# EAGLE schematic kryon-ver2.1-final (EAGLE 9.4.2)

## Sheet 1 of 8
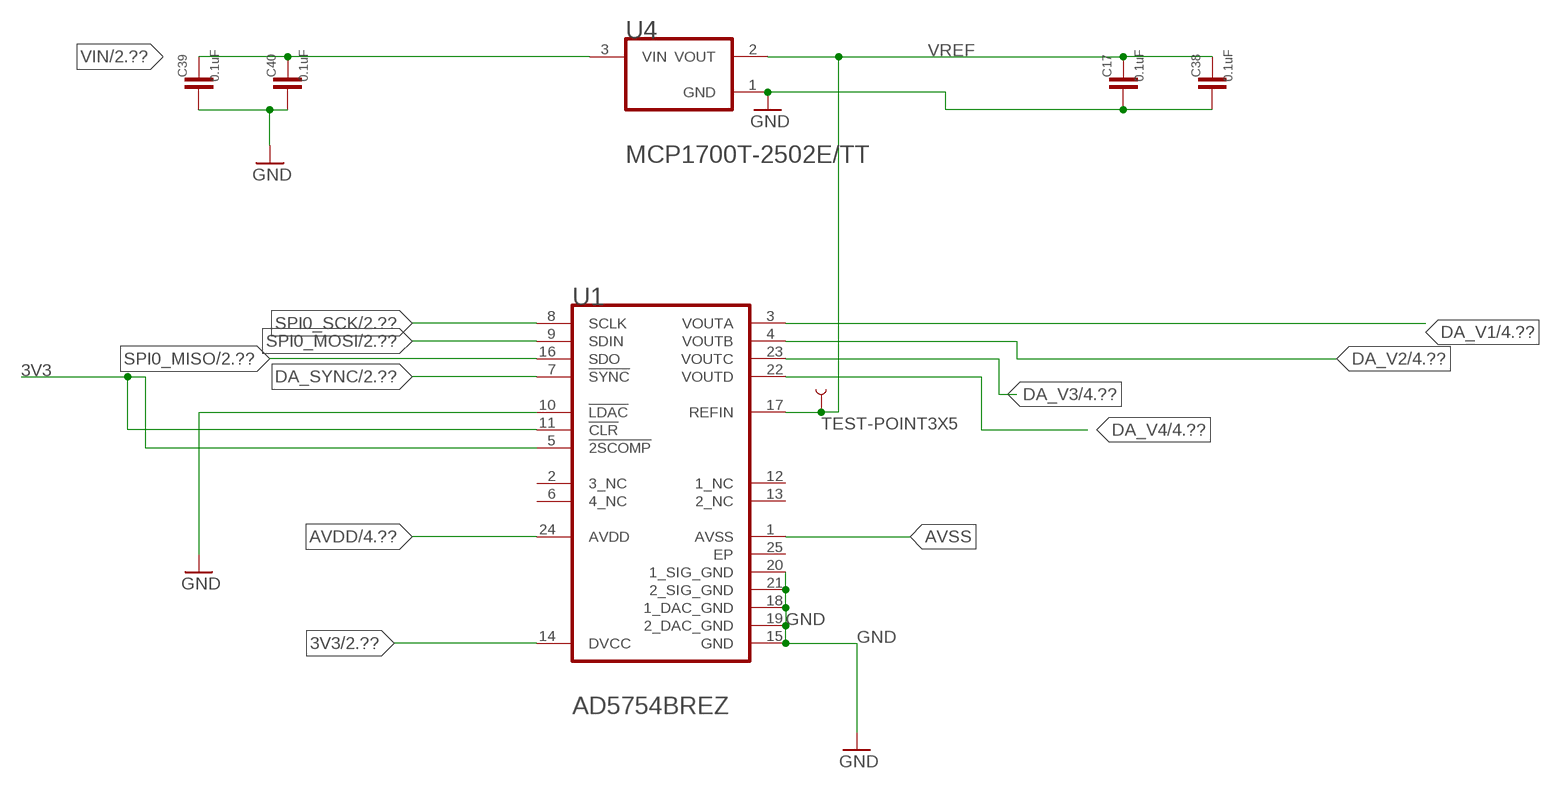
[diagram p0: schematic, sheet 1]

### Parts
C17  0.1uF  C-EUC1206  [C1206]
C38  0.1uF  C-EUC1206  [C1206]
C39  0.1uF  C-EUC1206  [C1206]
C40  0.1uF  C-EUC1206  [C1206]
TP1  TEST-POINT3X5  [PAD.03X.05]
U1  ANALOG_DEVICES_AD5754BREZANALOG_DEVICES_AD5754BREZ_0_2  [ANALOG_DEVICES_AD5754BREZ_2]
U4  MICROCHIP_MCP1700T-2502E-TTMICROCHIP_MCP1700T-2502E-TT_0_0  [MICROCHIP_MCP1700T-2502E-TT_0]

### Nets
3V3: U1.5(!2SCOMP!) U1.11(!CLR!) U1.14(DVCC) ; also sheet 2,3,4,5,6,7
AVDD: U1.24(AVDD) ; also sheet 3,4
AVSS: U1.1(AVSS) ; also sheet 3
DA_SYNC [defaultyyyy]: U1.7(!SYNC!) ; also sheet 2
DA_V1 [defaultyyyy]: U1.3(VOUTA) ; also sheet 4
DA_V2 [defaultyyyy]: U1.4(VOUTB) ; also sheet 4
DA_V3 [defaultyyyy]: U1.23(VOUTC) ; also sheet 4
DA_V4 [defaultyyyy]: U1.22(VOUTD) ; also sheet 4
GND: C17.2 C38.2 C39.2 C40.2 U1.10(!LDAC!) U1.15(GND) U1.18(1_DAC_GND) U1.19(2_DAC_GND) U1.20(1_SIG_GND) U1.21(2_SIG_GND) U4.1(GND) ; also sheet 2,3,4,5,6,8
SPI0_MISO [defaultyyyy]: U1.16(SDO) ; also sheet 2,5
SPI0_MOSI [defaultyyyy]: U1.9(SDIN) ; also sheet 2,4
SPI0_SCK [defaultyyyy]: U1.8(SCLK) ; also sheet 2,4,5
VIN: C39.1 C40.1 U4.3(VIN) ; also sheet 2,3,4,6
VREF: C17.1 C38.1 TP1.P$1 U1.17(REFIN) U4.2(VOUT)
Unconnected: U1.2(3_NC) U1.6(4_NC) U1.12(1_NC) U1.13(2_NC) U1.25(EP)

## Sheet 2 of 8
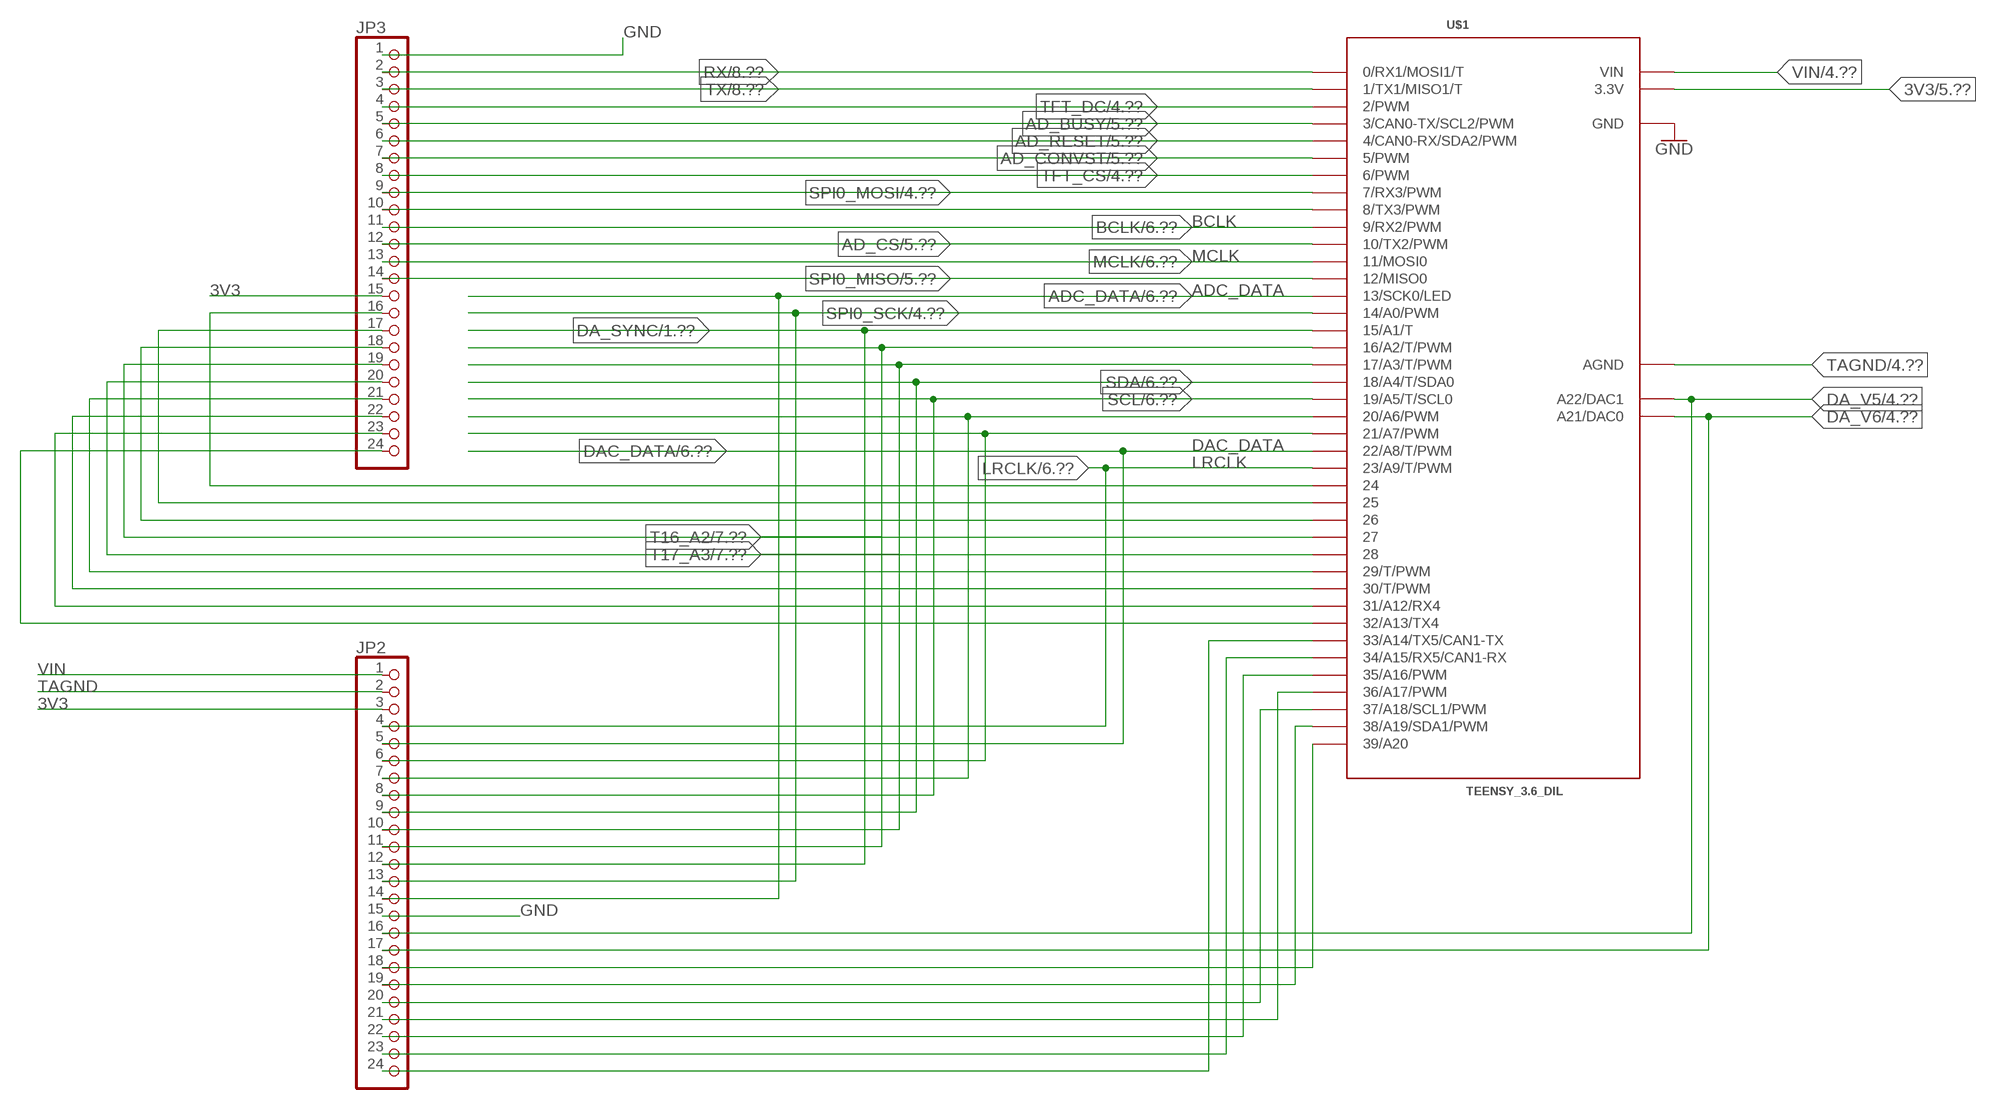
[diagram p1: schematic, sheet 2]

### Parts
JP2  PINHD-1X24  [1X24]
JP3  PINHD-1X24  [1X24]
U$1  TEENSY_3.6_DIL  [TEENSY_3.6_DIL]

### Nets
3V3: JP2.3 JP3.15 U$1.3.3V U$1.3.3V3(3.3V) ; also sheet 1,3,4,5,6,7
AD_BUSY [defaultyyyy]: JP3.5 U$1.3(3/CAN0-TX/SCL2/PWM) ; also sheet 5
AD_CONVST [defaultyyyy]: JP3.7 U$1.5(5/PWM) ; also sheet 5
AD_CS [defaultyyyy]: JP3.12 U$1.10(10/TX2/PWM) ; also sheet 5
AD_RESET [defaultyyyy]: JP3.6 U$1.4(4/CAN0-RX/SDA2/PWM) ; also sheet 5
ADC_DATA [defaultyyyy]: JP2.14 U$1.13(13/SCK0/LED) ; also sheet 6
BCLK [defaultyyyy]: JP3.11 U$1.9(9/RX2/PWM) ; also sheet 6
DA_SYNC [defaultyyyy]: JP2.12 U$1.15/A1(15/A1/T) ; also sheet 1
DA_V5 [defaultyyyy]: JP2.16 U$1.A22(A22/DAC1) ; also sheet 4
DA_V6 [defaultyyyy]: JP2.17 U$1.A21(A21/DAC0) ; also sheet 4
DAC_DATA [defaultyyyy]: JP2.5 U$1.22/A8(22/A8/T/PWM) ; also sheet 6
GND: JP2.15 JP3.1 U$1.GND U$1.GND1(GND) ; also sheet 1,3,4,5,6,8
LRCLK [defaultyyyy]: JP2.4 U$1.23/A9(23/A9/T/PWM) ; also sheet 6
MCLK [defaultyyyy]: JP3.13 U$1.11(11/MOSI0) ; also sheet 6
N$3 [defaultyyyy]: JP3.10 U$1.8(8/TX3/PWM)
N$4 [defaultyyyy]: JP2.7 U$1.20/A6(20/A6/PWM)
N$27 [defaultyyyy]: JP2.6 U$1.21/A7(21/A7/PWM)
N$28 [defaultyyyy]: JP3.16 U$1.24
N$29 [defaultyyyy]: JP3.17 U$1.25
N$31 [defaultyyyy]: JP3.18 U$1.26
N$32 [defaultyyyy]: JP3.19 U$1.27
N$33 [defaultyyyy]: JP3.20 U$1.28
N$34 [defaultyyyy]: JP3.21 U$1.29(29/T/PWM)
N$35 [defaultyyyy]: JP3.22 U$1.30(30/T/PWM)
N$36 [defaultyyyy]: JP3.23 U$1.31/A12(31/A12/RX4)
N$37 [defaultyyyy]: JP3.24 U$1.32/A13(32/A13/TX4)
N$38 [defaultyyyy]: JP2.18 U$1.39/A20
N$39 [defaultyyyy]: JP2.19 U$1.38/A19(38/A19/SDA1/PWM)
N$40 [defaultyyyy]: JP2.20 U$1.37/A18(37/A18/SCL1/PWM)
N$41 [defaultyyyy]: JP2.22 U$1.35/A16(35/A16/PWM)
N$42: JP2.21 U$1.36/A17(36/A17/PWM)
N$43 [defaultyyyy]: JP2.23 U$1.34/A15(34/A15/RX5/CAN1-RX)
N$44 [defaultyyyy]: JP2.24 U$1.33/A14(33/A14/TX5/CAN1-TX)
RX [defaultyyyy]: JP3.2 U$1.0(0/RX1/MOSI1/T) ; also sheet 8
SCL [defaultyyyy]: JP2.8 U$1.19/A5(19/A5/T/SCL0) ; also sheet 6
SDA [defaultyyyy]: JP2.9 U$1.18/A4(18/A4/T/SDA0) ; also sheet 6
SPI0_MISO [defaultyyyy]: JP3.14 U$1.12(12/MISO0) ; also sheet 1,5
SPI0_MOSI [defaultyyyy]: JP3.9 U$1.7(7/RX3/PWM) ; also sheet 1,4
SPI0_SCK [defaultyyyy]: JP2.13 U$1.14/A0(14/A0/PWM) ; also sheet 1,4,5
T16_A2 [defaultyyyy]: JP2.11 U$1.16/A2(16/A2/T/PWM) ; also sheet 7
T17_A3 [defaultyyyy]: JP2.10 U$1.17/A3(17/A3/T/PWM) ; also sheet 7
TAGND [defaultyyyy]: JP2.2 U$1.AGND ; also sheet 4,7
TFT_CS [defaultyyyy]: JP3.8 U$1.6(6/PWM) ; also sheet 4
TFT_DC [defaultyyyy]: JP3.4 U$1.2(2/PWM) ; also sheet 4
TX [defaultyyyy]: JP3.3 U$1.1(1/TX1/MISO1/T) ; also sheet 8
VIN: JP2.1 U$1.VIN ; also sheet 1,3,4,6

## Sheet 3 of 8
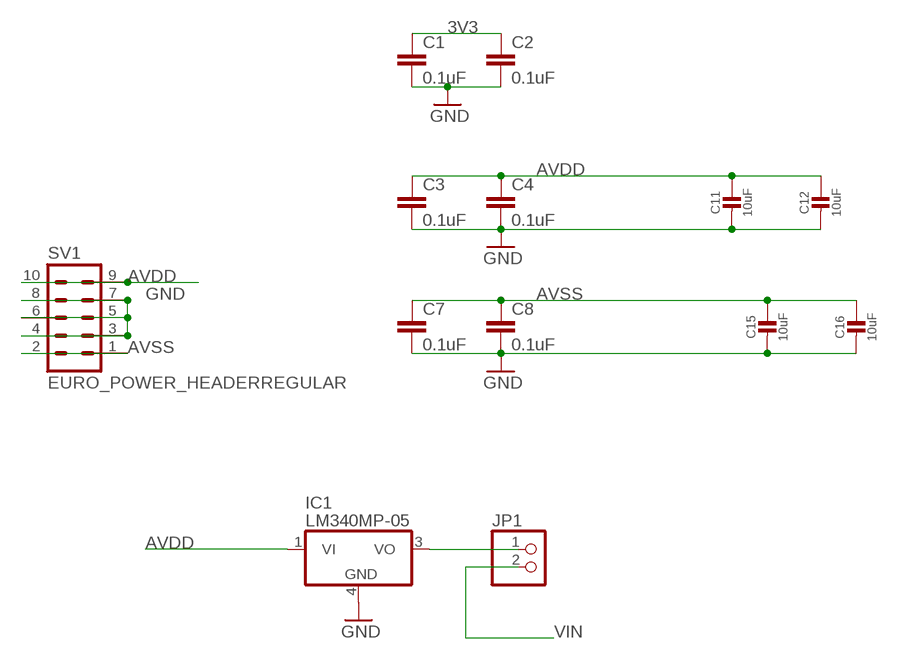
[diagram p2: schematic, sheet 3]

### Parts
C1  0.1uF  0.1UF-0603-25V-5%  [0603]
C2  0.1uF  0.1UF-0603-25V-5%  [0603]
C3  0.1uF  0.1UF-0603-25V-5%  [0603]
C4  0.1uF  0.1UF-0603-25V-5%  [0603]
C7  0.1uF  0.1UF-0603-25V-5%  [0603]
C8  0.1uF  0.1UF-0603-25V-5%  [0603]
C11  10uF  CAP_CERAMIC0805-NOOUTLINE  [0805-NO]
C12  10uF  CAP_CERAMIC0805-NOOUTLINE  [0805-NO]
C15  10uF  CAP_CERAMIC0805-NOOUTLINE  [0805-NO]
C16  10uF  CAP_CERAMIC0805-NOOUTLINE  [0805-NO]
IC1  LM340MP-05  [SOT223]
JP1  PINHD-1X2  [1X02]
SV1  EURO_POWER_HEADERREGULAR  [EURO_POWER_HEADER]

### Nets
3V3: C1.1 C2.1 ; also sheet 1,2,4,5,6,7
AVDD: C3.1 C4.1 C11.1 C12.1 IC1.1(VI) SV1.9 SV1.10 ; also sheet 1,4
AVSS: C7.1 C8.1 C15.1 C16.1 SV1.1 SV1.2 ; also sheet 1
GND: C1.2 C2.2 C3.2 C4.2 C7.2 C8.2 C11.2 C12.2 C15.2 C16.2 IC1.4(GND) SV1.3 SV1.4 SV1.5 SV1.6 SV1.7 SV1.8 ; also sheet 1,2,4,5,6,8
N$1 [defaultyyyy]: IC1.3(VO) JP1.1
VIN: JP1.2 ; also sheet 1,2,4,6

## Sheet 4 of 8
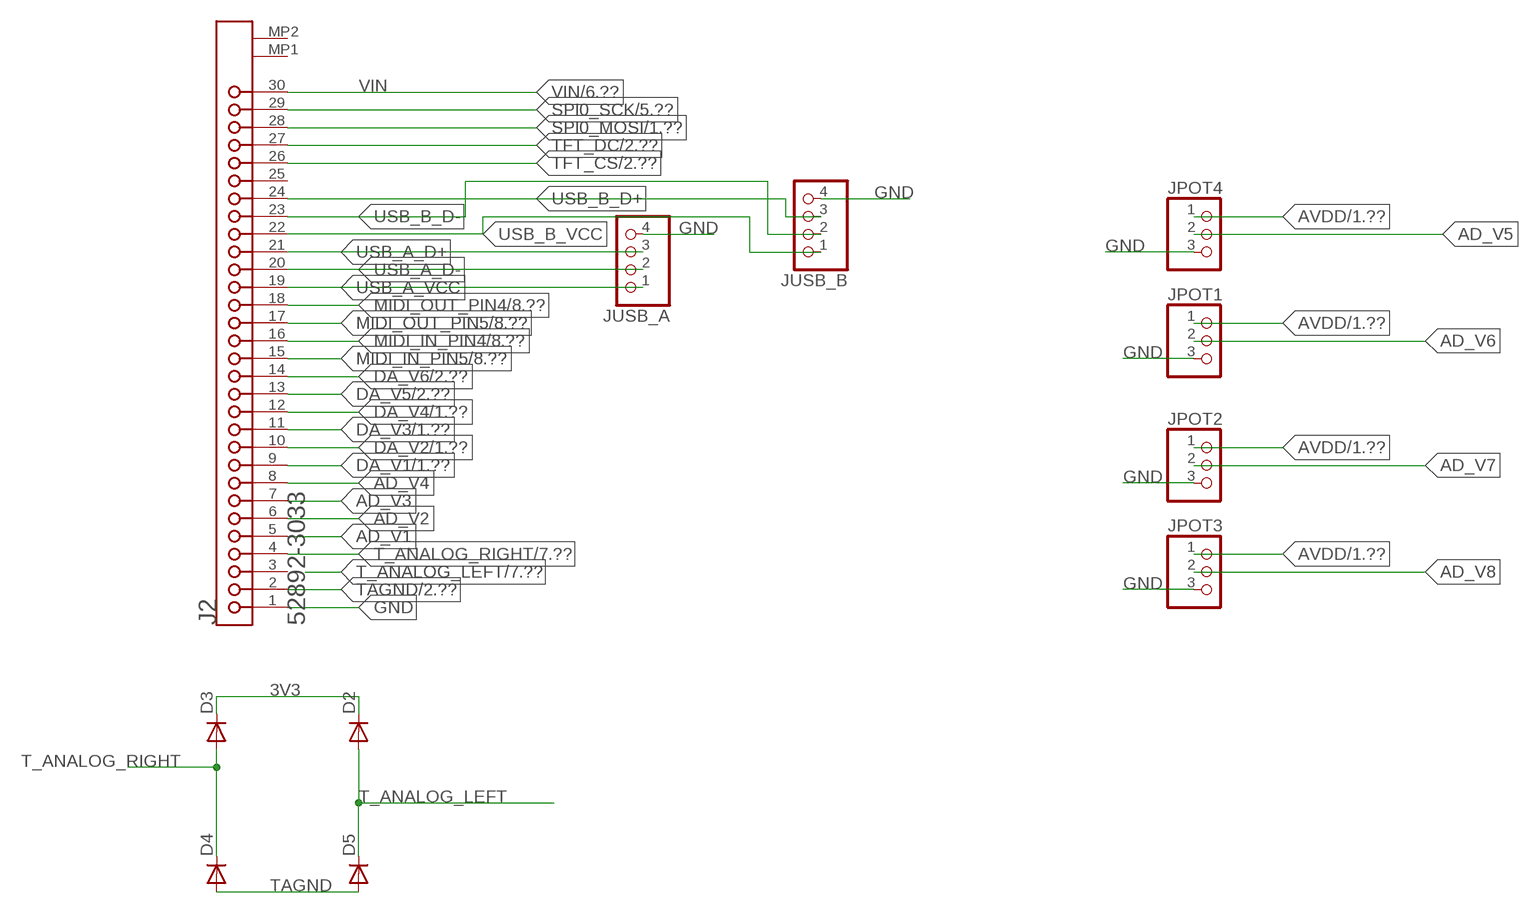
[diagram p3: schematic, sheet 4]

### Parts
D2  DIODESMA  [SMA-DIODE]
D3  DIODESMA  [SMA-DIODE]
D4  DIODESMA  [SMA-DIODE]
D5  DIODESMA  [SMA-DIODE]
J2  MOLEX_52892-3033MOLEX_52892-3033_0_0  [MOLEX_52892-3033_0]
JPOT1  PINHD-1X3  [1X03]
JPOT2  PINHD-1X3  [1X03]
JPOT3  PINHD-1X3  [1X03]
JPOT4  PINHD-1X3  [1X03]
JUSB_A  PINHD-1X4  [1X04]
JUSB_B  PINHD-1X4  [1X04]

### Nets
3V3: D2.C D3.C ; also sheet 1,2,3,5,6,7
AD_V1 [defaultyyyy]: J2.5 ; also sheet 5
AD_V2 [defaultyyyy]: J2.6 ; also sheet 5
AD_V3 [defaultyyyy]: J2.7 ; also sheet 5
AD_V4 [defaultyyyy]: J2.8 ; also sheet 5
AD_V5 [defaultyyyy]: JPOT4.2 ; also sheet 5
AD_V6 [defaultyyyy]: JPOT1.2 ; also sheet 5
AD_V7 [defaultyyyy]: JPOT2.2 ; also sheet 5
AD_V8 [defaultyyyy]: JPOT3.2 ; also sheet 5
AVDD: JPOT1.1 JPOT2.1 JPOT3.1 JPOT4.1 ; also sheet 1,3
DA_V1 [defaultyyyy]: J2.9 ; also sheet 1
DA_V2 [defaultyyyy]: J2.10 ; also sheet 1
DA_V3 [defaultyyyy]: J2.11 ; also sheet 1
DA_V4 [defaultyyyy]: J2.12 ; also sheet 1
DA_V5 [defaultyyyy]: J2.13 ; also sheet 2
DA_V6 [defaultyyyy]: J2.14 ; also sheet 2
GND: J2.1 JPOT1.3 JPOT2.3 JPOT3.3 JPOT4.3 JUSB_A.4 JUSB_B.4 ; also sheet 1,2,3,5,6,8
MIDI_IN_PIN4 [defaultyyyy]: J2.16 ; also sheet 8
MIDI_IN_PIN5 [defaultyyyy]: J2.15 ; also sheet 8
MIDI_OUT_PIN4 [defaultyyyy]: J2.18 ; also sheet 8
MIDI_OUT_PIN5 [defaultyyyy]: J2.17 ; also sheet 8
SPI0_MOSI [defaultyyyy]: J2.28 ; also sheet 1,2
SPI0_SCK [defaultyyyy]: J2.29 ; also sheet 1,2,5
T_ANALOG_LEFT [defaultyyyy]: D2.A D5.C ; also sheet 7
T_ANALOG_RIGHT [defaultyyyy]: D3.A D4.C J2.4 ; also sheet 7
TAGND [defaultyyyy]: D4.A D5.A J2.2 ; also sheet 2,7
TFT_CS [defaultyyyy]: J2.26 ; also sheet 2
TFT_DC [defaultyyyy]: J2.27 ; also sheet 2
USB_A_D+ [defaultyyyy]: J2.21 JUSB_A.3
USB_A_D- [defaultyyyy]: J2.20 JUSB_A.2
USB_A_VCC [defaultyyyy]: J2.19 JUSB_A.1
USB_B_D+ [defaultyyyy]: J2.24 JUSB_B.3
USB_B_D- [defaultyyyy]: J2.23 JUSB_B.2
USB_B_VCC [defaultyyyy]: J2.22 JUSB_B.1
VIN: J2.30 ; also sheet 1,2,3,6
Unconnected: J2.3 J2.25 J2.MP1 J2.MP2

## Sheet 5 of 8
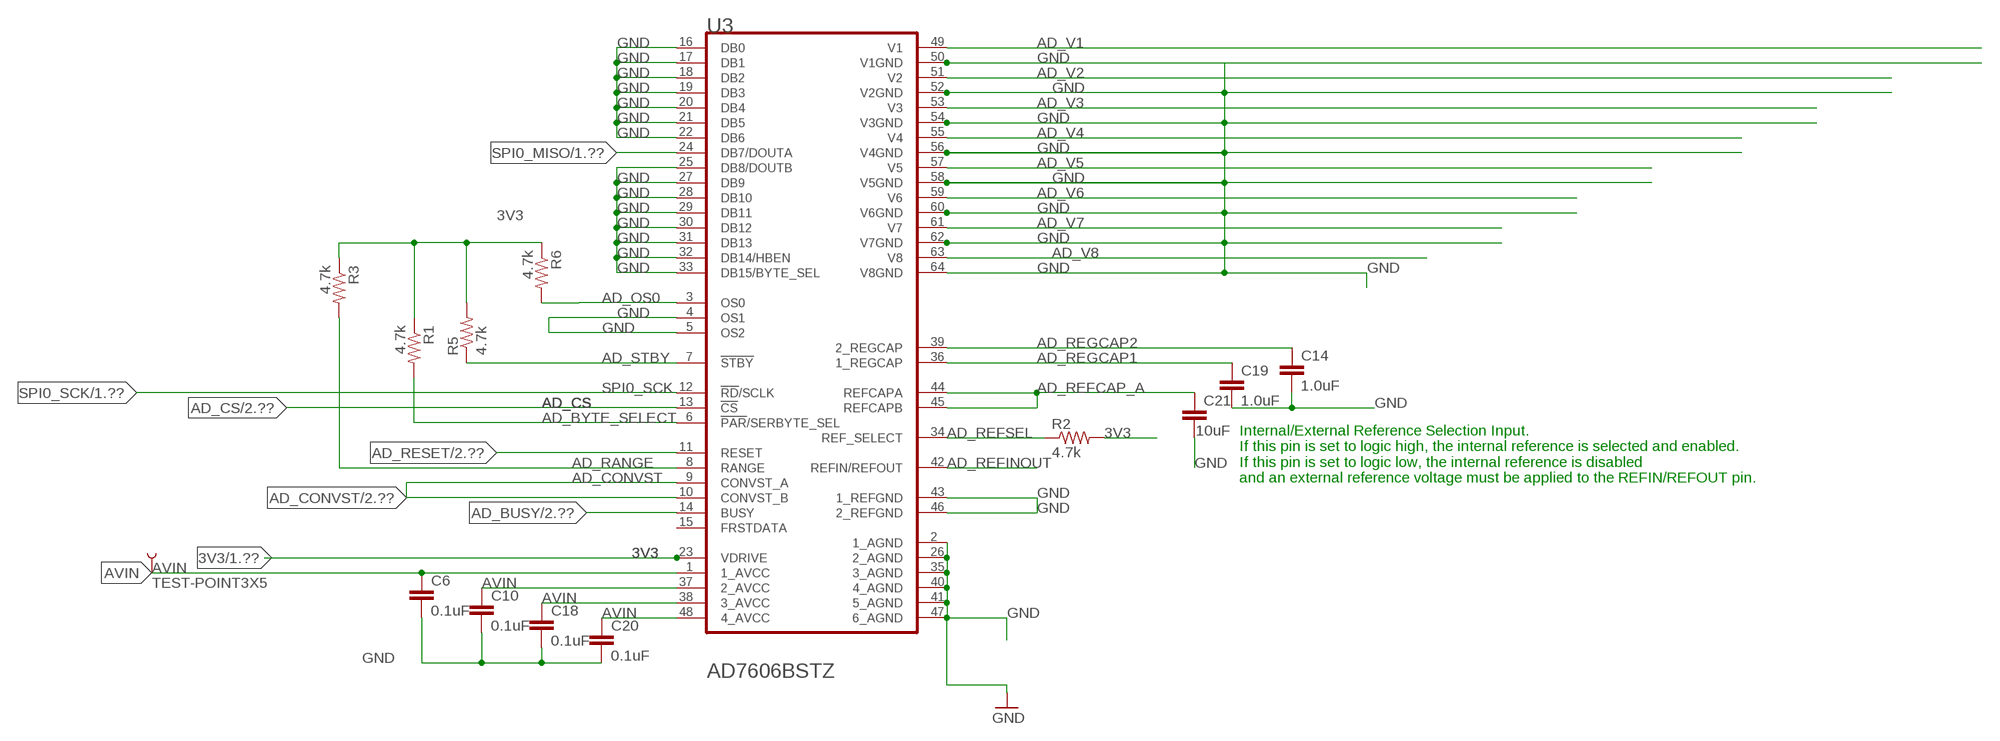
[diagram p4: schematic, sheet 5]

### Parts
C6  0.1uF  0.1UF-0603-25V-5%  [0603]
C10  0.1uF  0.1UF-0603-25V-5%  [0603]
C14  1.0uF  1.0UF-1206-50V-10%  [1206]
C18  0.1uF  0.1UF-0603-25V-5%  [0603]
C19  1.0uF  1.0UF-1206-50V-10%  [1206]
C20  0.1uF  0.1UF-0603-25V-5%  [0603]
C21  10uF  10UF-1206-6.3V-20%  [1206]
R1  4.7k  R-US_R0805  [R0805]
R2  4.7k  R-US_R0805  [R0805]
R3  4.7k  R-US_R0805  [R0805]
R5  4.7k  R-US_R0805  [R0805]
R6  4.7k  R-US_R0805  [R0805]
TP2  TEST-POINT3X5  [PAD.03X.05]
U3  ANALOG_DEVICES_AD7606BSTZANALOG_DEVICES_AD7606BSTZ_0_2  [ANALOG_DEVICES_AD7606BSTZ_2]

### Nets
3V3: R1.1 R2.2 R3.1 R5.2 R6.1 U3.23(VDRIVE) ; also sheet 1,2,3,4,6,7
AD_BUSY [defaultyyyy]: U3.14(BUSY) ; also sheet 2
AD_BYTE_SELECT [defaultyyyy]: R1.2 U3.6(!PAR!/SERBYTE_SEL)
AD_CONVST [defaultyyyy]: U3.9(CONVST_A) U3.10(CONVST_B) ; also sheet 2
AD_CS [defaultyyyy]: U3.13(!CS!) ; also sheet 2
AD_OS0 [defaultyyyy]: R6.2 U3.3(OS0)
AD_RANGE [defaultyyyy]: R3.2 U3.8(RANGE)
AD_REFCAP_A [defaultyyyy]: C21.1 U3.44(REFCAPA) U3.45(REFCAPB)
AD_REFINOUT [defaultyyyy]: U3.42(REFIN/REFOUT)
AD_REFSEL [defaultyyyy]: R2.1 U3.34(REF_SELECT)
AD_REGCAP1 [defaultyyyy]: C19.1 U3.36(1_REGCAP)
AD_REGCAP2 [defaultyyyy]: C14.1 U3.39(2_REGCAP)
AD_RESET [defaultyyyy]: U3.11(RESET) ; also sheet 2
AD_STBY [defaultyyyy]: R5.1 U3.7(!STBY!)
AD_V1 [defaultyyyy]: U3.49(V1) ; also sheet 4
AD_V2 [defaultyyyy]: U3.51(V2) ; also sheet 4
AD_V3 [defaultyyyy]: U3.53(V3) ; also sheet 4
AD_V4 [defaultyyyy]: U3.55(V4) ; also sheet 4
AD_V5 [defaultyyyy]: U3.57(V5) ; also sheet 4
AD_V6 [defaultyyyy]: U3.59(V6) ; also sheet 4
AD_V7 [defaultyyyy]: U3.61(V7) ; also sheet 4
AD_V8 [defaultyyyy]: U3.63(V8) ; also sheet 4
AVIN: C6.1 C10.1 C18.1 C20.1 TP2.P$1 U3.1(1_AVCC) U3.37(2_AVCC) U3.38(3_AVCC) U3.48(4_AVCC) ; also sheet 6
GND: C6.2 C10.2 C14.2 C18.2 C19.2 C20.2 C21.2 U3.2(1_AGND) U3.4(OS1) U3.5(OS2) U3.16(DB0) U3.17(DB1) U3.18(DB2) U3.19(DB3) U3.20(DB4) U3.21(DB5) U3.22(DB6) U3.25(DB8/DOUTB) U3.26(2_AGND) U3.27(DB9) U3.28(DB10) U3.29(DB11) U3.30(DB12) U3.31(DB13) U3.32(DB14/HBEN) U3.33(DB15/BYTE_SEL) U3.35(3_AGND) U3.40(4_AGND) U3.41(5_AGND) U3.43(1_REFGND) U3.46(2_REFGND) U3.47(6_AGND) U3.50(V1GND) U3.52(V2GND) U3.54(V3GND) U3.56(V4GND) U3.58(V5GND) U3.60(V6GND) U3.62(V7GND) U3.64(V8GND) ; also sheet 1,2,3,4,6,8
SPI0_MISO [defaultyyyy]: U3.24(DB7/DOUTA) ; also sheet 1,2
SPI0_SCK [defaultyyyy]: U3.12(!RD!/SCLK) ; also sheet 1,2,4
Unconnected: U3.15(FRSTDATA)

### Notes on the sheet
- Internal/External Reference Selection Input. 
  If this pin is set to logic high, the internal reference is selected and enabled. 
  If this pin is set to logic low, the internal reference is disabled 
  and an external reference voltage must be applied to the REFIN/REFOUT pin.

## Sheet 6 of 8: codec
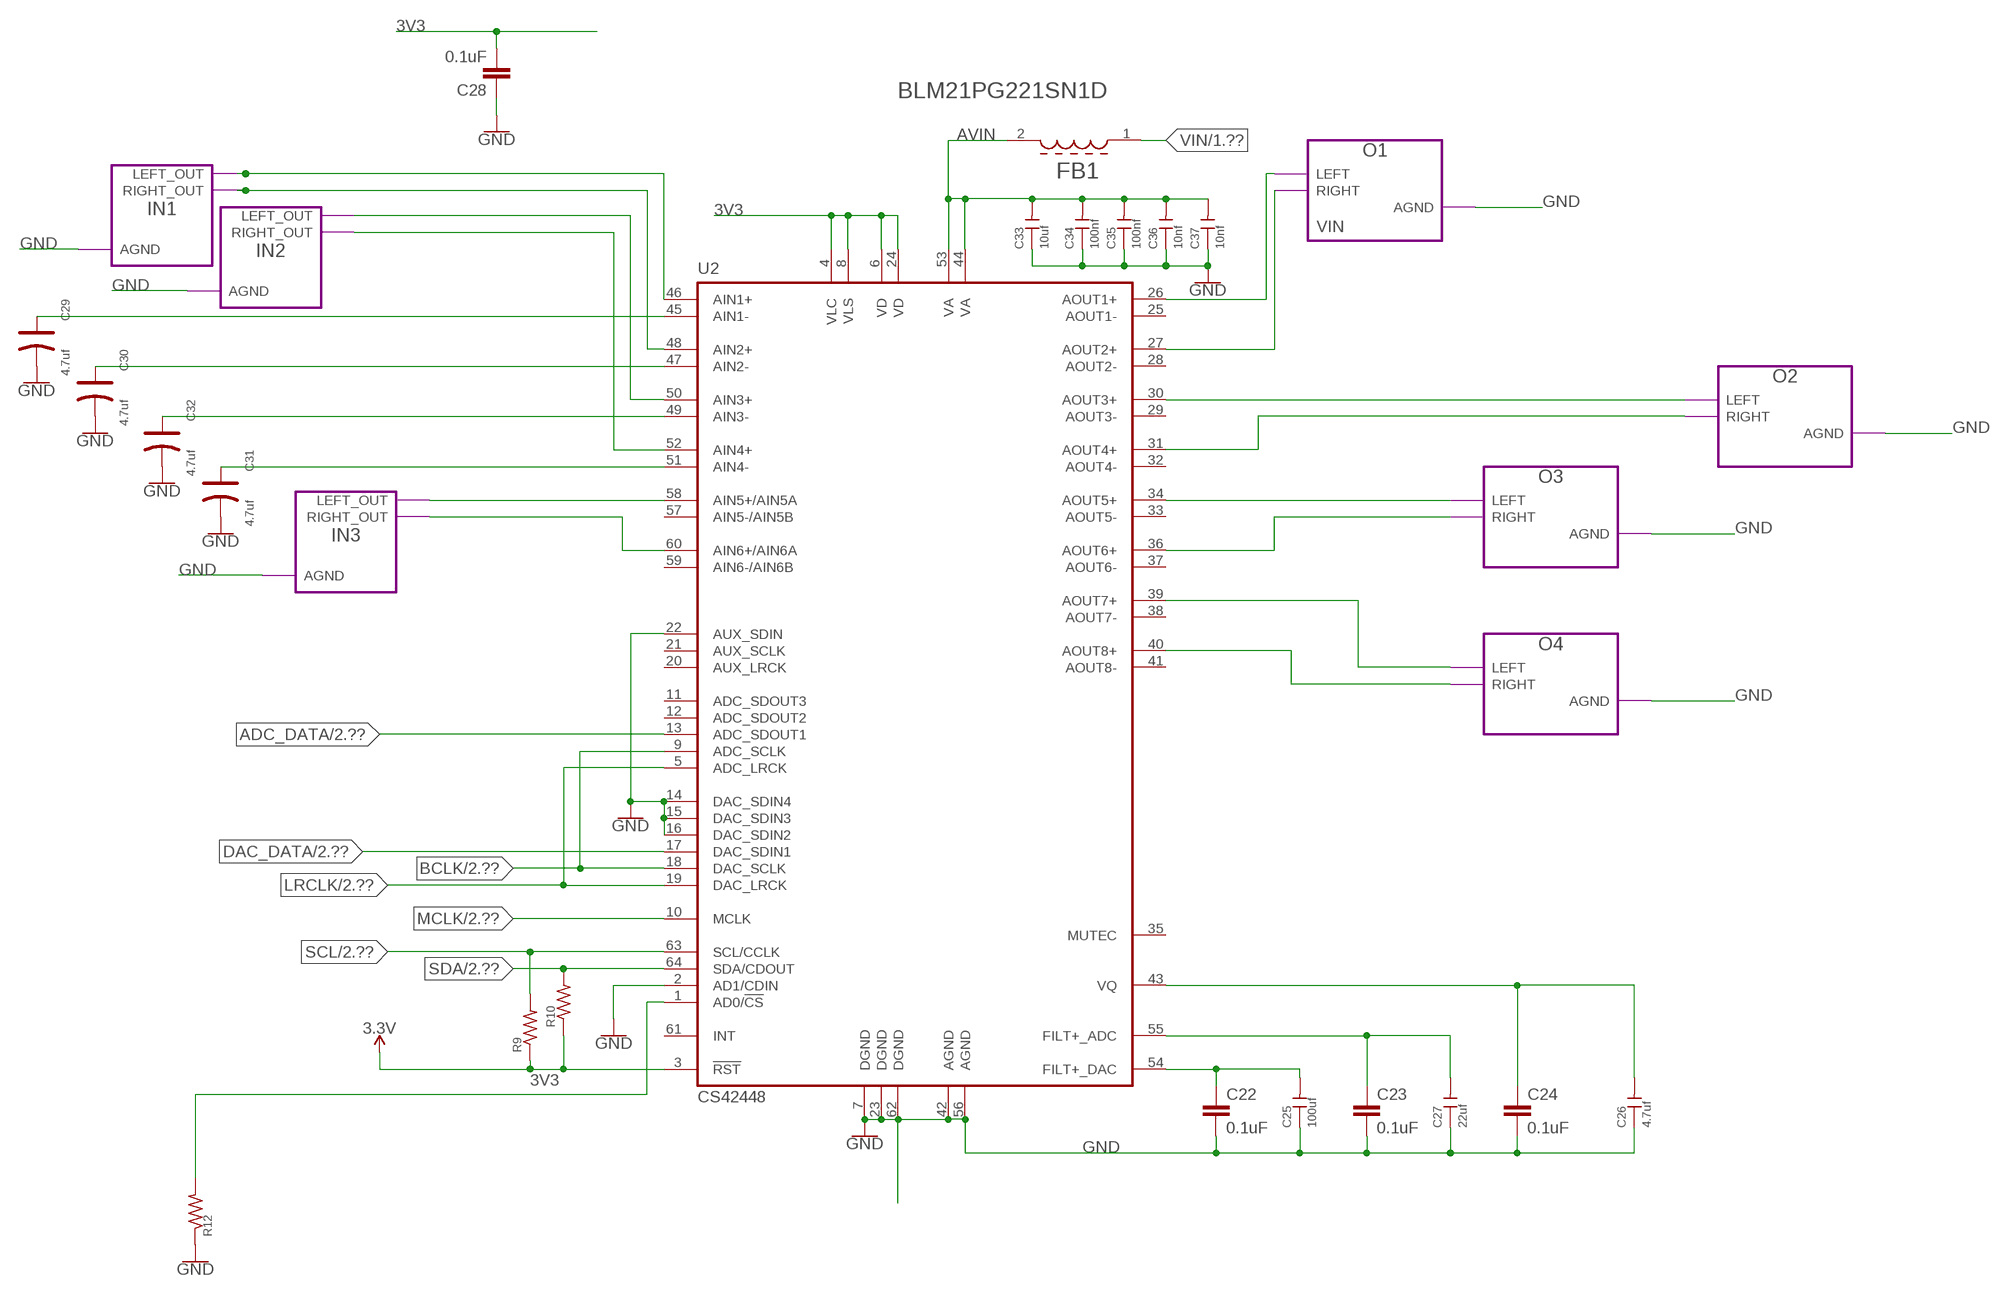
[diagram p5: schematic, sheet 6]

### Parts
C22  0.1uF  0.1UF-0603-25V-5%  [0603]
C23  0.1uF  0.1UF-0603-25V-5%  [0603]
C24  0.1uF  0.1UF-0603-25V-5%  [0603]
C25  100uf  CERAMIC-100UF-6.3V-20%-X5R(1206)  [C1206]
C26  4.7uf  CERAMIC-4.7UF-25V-10%-X5R(0805)  [C0805]
C27  22uf  CERAMIC-22UF-6.3V-20%-X5R(0805)  [C0805]
C28  0.1uF  0.1UF-0603-25V-5%  [0603]
C29  4.7uf  TANTALUM-SMD-4.7UF-16V(AVX-A)  [AVX-A]
C30  4.7uf  TANTALUM-SMD-4.7UF-16V(AVX-A)  [AVX-A]
C31  4.7uf  TANTALUM-SMD-4.7UF-16V(AVX-A)  [AVX-A]
C32  4.7uf  TANTALUM-SMD-4.7UF-16V(AVX-A)  [AVX-A]
C33  10uf  CERAMIC-10UF-25V-10%-X5R(0805)  [C0805]
C34  100nf  CERAMIC-100NF-50V-10%-X7R(0805)  [C0805]
C35  100nf  CERAMIC-100NF-50V-10%-X7R(0805)  [C0805]
C36  10nf  CERAMIC-10NF-50V-5%-X7R(0805)  [C0805]
C37  10nf  CERAMIC-10NF-50V-5%-X7R(0805)  [C0805]
FB1  MURATA_BLM21PG221SN1DMURATA_BLM21PG221SN1D_0_1  [MURATA_BLM21PG221SN1D_1]
R9  2K  R-US_R0805  [R0805]
R10  2K  R-US_R0805  [R0805]
R12  2K  R-US_R0805  [R0805]
U2  CS42448  [LQFP64L]

### Module instances
O1 = STEREO_OUT
O2 = STEREO_OUT
O3 = STEREO_OUT
O4 = STEREO_OUT
IN1 = STEREO_IN
IN2 = STEREO_IN
IN3 = STEREO_IN

### Nets
3V3: C28.2 R9.1 R10.1 U2.3(!RST!) U2.4(VLC) U2.6(VD) U2.8(VLS) U2.24(VD) ; supply symbol labelled 3.3V ; also sheet 1,2,3,4,5,7
ADC_DATA [defaultyyyy]: U2.13(ADC_SDOUT1) ; also sheet 2
AVIN: C33.2 C34.2 C35.2 C36.2 C37.2 FB1.2 U2.44(VA) U2.53(VA) ; also sheet 5
BCLK [defaultyyyy]: U2.9(ADC_SCLK) U2.18(DAC_SCLK) ; also sheet 2
DAC_DATA [defaultyyyy]: U2.17(DAC_SDIN1) ; also sheet 2
GND: C22.2 C23.2 C24.2 C25.1 C26.1 C27.1 C28.1 C29.- C30.- C31.- C32.- C33.1 C34.1 C35.1 C36.1 C37.1 R12.1 U2.2(AD1/CDIN) U2.7(DGND) U2.14(DAC_SDIN4) U2.15(DAC_SDIN3) U2.16(DAC_SDIN2) U2.22(AUX_SDIN) U2.23(DGND) U2.42(AGND) U2.56(AGND) U2.62(DGND) ; port O1.AGND IN1.AGND IN2.AGND IN3.AGND O2.AGND O3.AGND O4.AGND ; also sheet 1,2,3,4,5,8
LRCLK [defaultyyyy]: U2.5(ADC_LRCK) U2.19(DAC_LRCK) ; also sheet 2
MCLK [defaultyyyy]: U2.10(MCLK) ; also sheet 2
N$5 [defaultyyyy]: C22.1 C25.2 U2.54(FILT+_DAC)
N$6 [defaultyyyy]: C23.1 C27.2 U2.55(FILT+_ADC)
N$7 [defaultyyyy]: C24.1 C26.2 U2.43(VQ)
N$8 [defaultyyyy]: C29.+ U2.45(AIN1-)
N$9 [defaultyyyy]: C30.+ U2.47(AIN2-)
N$10 [defaultyyyy]: U2.46(AIN1+) ; port IN1.LEFT_OUT
N$12 [defaultyyyy]: U2.48(AIN2+) ; port IN1.RIGHT_OUT
N$13 [defaultyyyy]: U2.58(AIN5+/AIN5A) ; port IN3.LEFT_OUT
N$14 [defaultyyyy]: U2.52(AIN4+) ; port IN2.RIGHT_OUT
N$15 [defaultyyyy]: U2.50(AIN3+) ; port IN2.LEFT_OUT
N$16 [defaultyyyy]: C31.+ U2.51(AIN4-)
N$17 [defaultyyyy]: U2.26(AOUT1+) ; port O1.LEFT
N$18 [defaultyyyy]: U2.27(AOUT2+) ; port O1.RIGHT
N$19 [defaultyyyy]: U2.30(AOUT3+) ; port O2.LEFT
N$20 [defaultyyyy]: C32.+ U2.49(AIN3-)
N$21 [defaultyyyy]: U2.31(AOUT4+) ; port O2.RIGHT
N$22 [defaultyyyy]: U2.34(AOUT5+) ; port O3.LEFT
N$23 [defaultyyyy]: U2.36(AOUT6+) ; port O3.RIGHT
N$24 [defaultyyyy]: U2.39(AOUT7+) ; port O4.LEFT
N$25 [defaultyyyy]: U2.40(AOUT8+) ; port O4.RIGHT
N$26 [defaultyyyy]: R12.2 U2.1(AD0/!CS!)
N$30 [defaultyyyy]: U2.60(AIN6+/AIN6A) ; port IN3.RIGHT_OUT
SCL [defaultyyyy]: R9.2 U2.63(SCL/CCLK) ; also sheet 2
SDA [defaultyyyy]: R10.2 U2.64(SDA/CDOUT) ; also sheet 2
VIN: FB1.1 ; also sheet 1,2,3,4
Unconnected: U2.11(ADC_SDOUT3) U2.12(ADC_SDOUT2) U2.20(AUX_LRCK) U2.21(AUX_SCLK) U2.25(AOUT1-) U2.28(AOUT2-) U2.29(AOUT3-) U2.32(AOUT4-) U2.33(AOUT5-) U2.35(MUTEC) U2.37(AOUT6-) U2.38(AOUT7-) U2.41(AOUT8-) U2.57(AIN5-/AIN5B) U2.59(AIN6-/AIN6B) U2.61(INT)

## Sheet 7 of 8
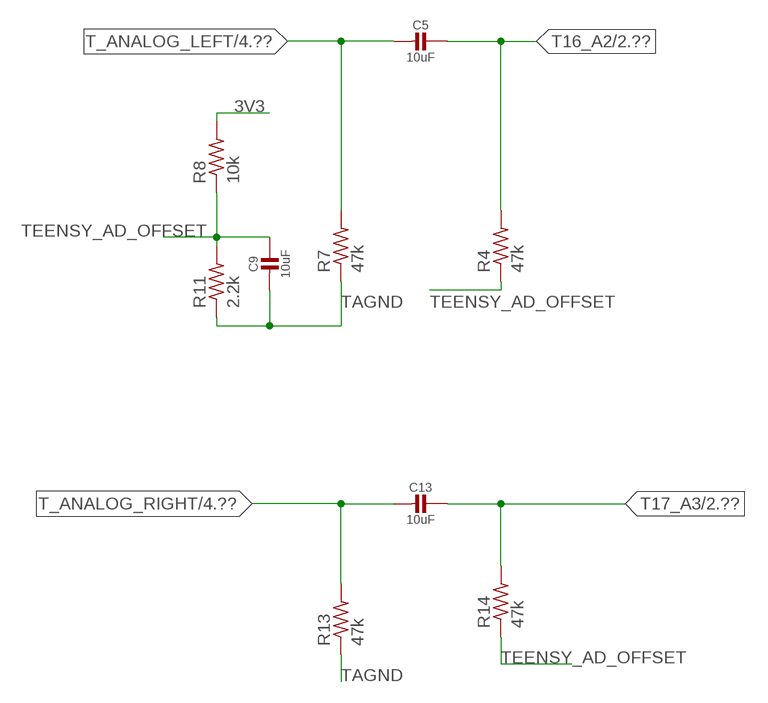
[diagram p6: schematic, sheet 7]

### Parts
C5  10uF  CAP_CERAMIC0805-NOOUTLINE  [0805-NO]
C9  10uF  CAP_CERAMIC0805-NOOUTLINE  [0805-NO]
C13  10uF  CAP_CERAMIC0805-NOOUTLINE  [0805-NO]
R4  47k  R-US_R0805  [R0805]
R7  47k  R-US_R0805  [R0805]
R8  10k  R-US_R0805  [R0805]
R11  2.2k  R-US_R0805  [R0805]
R13  47k  R-US_R0805  [R0805]
R14  47k  R-US_R0805  [R0805]

### Nets
3V3: R8.2 ; also sheet 1,2,3,4,5,6
T16_A2 [defaultyyyy]: C5.1 R4.2 ; also sheet 2
T17_A3 [defaultyyyy]: C13.1 R14.2 ; also sheet 2
T_ANALOG_LEFT [defaultyyyy]: C5.2 R7.2 ; also sheet 4
T_ANALOG_RIGHT [defaultyyyy]: C13.2 R13.2 ; also sheet 4
TAGND [defaultyyyy]: C9.2 R7.1 R11.1 R13.1 ; also sheet 2,4
TEENSY_AD_OFFSET [defaultyyyy]: C9.1 R4.1 R8.1 R11.2 R14.1

## Sheet 8 of 8: Midi
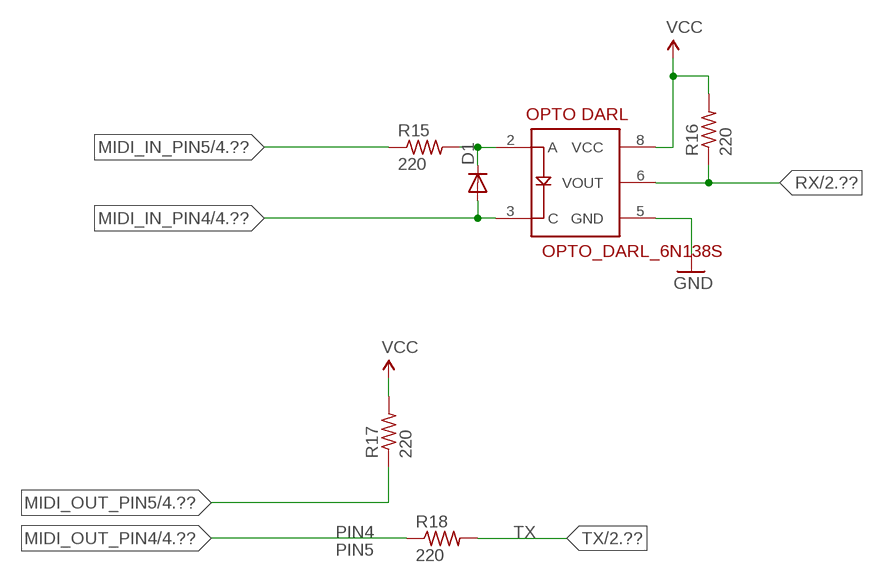
[diagram p7: schematic, sheet 8]

### Parts
D1  DIODESMA  [SMA-DIODE]
R15  220  R-US_R0805  [R0805]
R16  220  R-US_R0805  [R0805]
R17  220  R-US_R0805  [R0805]
R18  220  R-US_R0805  [R0805]
U$2  OPTO_DARL_6N138S  [8-SMD]

### Nets
56 [defaultyyyy]: D1.C R15.2 U$2.2(A)
GND: U$2.5(GND) ; also sheet 1,2,3,4,5,6
MIDI_IN_PIN4 [defaultyyyy]: D1.A U$2.3(C) ; also sheet 4
MIDI_IN_PIN5 [defaultyyyy]: R15.1 ; also sheet 4
MIDI_OUT_PIN4 [defaultyyyy]: R18.1 ; also sheet 4
MIDI_OUT_PIN5 [defaultyyyy]: R17.1 ; also sheet 4
RX [defaultyyyy]: R16.1 U$2.6(VOUT) ; also sheet 2
TX [defaultyyyy]: R18.2 ; also sheet 2
VCC: R16.2 R17.2 U$2.8(VCC)

### Notes on the sheet
- PIN4
- PIN5

## Library data of the parts
C1-C4 C6-C8 C10 C18 C20 C22-C24 C28 = SparkFun-Capacitors:0.1UF: 0.1µF ceramic capacitors A capacitor is a passive two-terminal electrical component used to store electrical energy temporarily in an electric field.; PROD_ID: CAP-08604
C5 C9 C11-C13 C15 C16 = audio amplifier example:CAP_CERAMIC
C14 C19 = SparkFun-Capacitors:1.0UF: 1µF ceramic capacitors A capacitor is a passive two-terminal electrical component used to store electrical energy temporarily in an electric field.; PROD_ID: CAP-09822
C17 C38-C40 = resistor-nick:C-EU: CAPACITOR, European symbol
C21 = SparkFun-Capacitors:10UF: 10.0µF ceramic capacitors A capacitor is a passive two-terminal electrical component used to store electrical energy temporarily in an electric field.; PROD_ID: CAP-10057
C25 = Seeed-Capacitor:CERAMIC-100UF-6.3V-20%-X5R(1206): 302010183; MPN: GRM31CR60J107ME39L
C26 = Seeed-Capacitor:CERAMIC-4.7UF-25V-10%-X5R(0805): 302010146; MPN: CC0805KKX5R8BB475
C27 = Seeed-Capacitor:CERAMIC-22UF-6.3V-20%-X5R(0805): 302010171; MPN: CC0805MKX5R5BB226
C29-C32 = Seeed-Capacitor:TANTALUM-SMD-4.7UF-16V(AVX-A): 302020006; MPN: TAJA475*016#NJ
C33 = Seeed-Capacitor:CERAMIC-10UF-25V-10%-X5R(0805): 302010178; MPN: CC0805KKX5R8BB106
C34 C35 = Seeed-Capacitor:CERAMIC-100NF-50V-10%-X7R(0805): 302010165; MPN: CC0805KRX7R9BB104
C36 C37 = Seeed-Capacitor:CERAMIC-10NF-50V-5%-X7R(0805): 302010175; MPN: CC0805JRX7R9BB103
D1-D5 = SparkFun:DIODE: Diode These are standard reverse protection diodes and small signal diodes. SMA package can handle up to about 1A. SOD-323 can handle about 200mA. What the SOD-323 package when ordering, there are some mfgs out there that are 5-pin packages.
FB1 = Murata - BLM21PG221SN1D:MURATA_BLM21PG221SN1D: MURA-FB-2; CIIVA_IDS: 886556; COMPONENT_LINK_1_DESCRIPTION: Manufacturer URL; COMPONENT_LINK_1_URL: http://www.murata.com/; COMPONENT_LINK_3_DESCRIPTION: Package Specification; COMPONENT_LINK_3_URL: http://www.murata.com/products/catalog/pdf/c31e.pdf; DATASHEET: http://www.murata.com/products/catalog/pdf/c31e.pdf; DATASHEET_VERSION: 08/2013; DC_RESISTANCE: 0.045 Ohm Max.; FOOTPRINT_VARIANT_NAME_0: MURA-BLM21-B20-CHIP-2_V2; FOOTPRINT_VARIANT_NAME_1: MURA-BLM21-B20-CHIP-2_V1; IMPEDANCE_AT_100_MHZ: 220 Ohm +/- 25%; IMPORTED: yes; IMPORTED_FROM: vault; IMPORT_TS: 1521843617; MF: Murata; MOUNTING_TECHNOLOGY: Surface Mount; MPN: BLM21PG221SN1D; OPERATING_TEMPERATURE_RANGE: -55 to 125 degC; PACKAGE: BLM21_H1050-2; PACKAGE_DESCRIPTION: 2-Pin Chip, Body 2 x 1.25 mm; PACKING: Tape and Reel; PREFIX: FB; RATED_CURRENT: 2000 mA; RELEASE_DATE: 1390571351; VAULT_GUID: D6414E20-2109-4A17-A638-53E055BFA7B6; VAULT_REVISION: E9EAA9AD-C8DD-4E35-B9CB-2397DCCBD7BA
IC1 = linear:LM340?-*: Positive VOLTAGE REGULATOR Source: http://cache.national.com/ds/LM/LM340.pdf
J2 = Molex - 52892-3033:MOLEX_52892-3033: MOLX-52892-3033; CIIVA_IDS: 12958047; CIRCUITS_LOADED: 30; COMPONENT_LINK_1_DESCRIPTION: Manufacturer URL; COMPONENT_LINK_1_URL: http://www.molex.com/molex/index.jsp; COMPONENT_LINK_3_DESCRIPTION: Package Specification; COMPONENT_LINK_3_URL: http://www.molex.com/pdm_docs/sd/528923033_sd.pdf; CONTACT_POSITION: Bottom; CURRENT_MAX_PER_CONTACT: 0.5A; DATASHEET: http://www.molex.com/webdocs/datasheets/pdf/en-us/0528923033_FFC_FPC_CONNECTORS.pdf; DURABILITY_MATING_CYCLES_MAX: 20; ENTRY_ANGLE: 90degrees Angle; FOOTPRINT_VARIANT_NAME_0: Manufacturer Recommended; IMPORTED: yes; IMPORTED_FROM: vault; IMPORT_TS: 1521848668; MATED_HEIGHT: 2.00mm; MATERIAL___METAL: Phosphor Bronze; MATERIAL___PLATING_MATING: Silver, Tin-Bismuth; MATERIAL___PLATING_TERMINATION: Silver, Tin-Bismuth; MF: Molex; MOUNTING_TECHNOLOGY: Surface Mount; MPN: 52892-3033; NUMBER_OF_ROWS: 1; ORIENTATION: Right Angle; PACKAGE: 52892-3033; PACKAGE_DESCRIPTION: 30-Lead FPC Connector, Pitch 0.5 mm; PACKAGE_VERSION: Rev. A, 05/2013; PACKING: Tape and Reel; PCB_LOCATOR: No; PCB_RETENTION: Yes; PITCH___MATING_INTERFACE: 0.50mm; PITCH___TERMINATION_INTERFACE: 0.50mm; POLARIZED_TO_PCB: No; PREFIX: J; RELEASE_DATE: 1411387070; ROHS: Yes; STACKABLE: No; VAULT_GUID: 0169C182-1258-4790-B51B-8D965E90A908; VAULT_REVISION: 36DEA303-18DB-4C92-B706-163F4C1D6A90; VOLTAGE_MAX: 50V
JP1 = pinhead:PINHD-1X2: PIN HEADER
JP2 JP3 = pinhead:PINHD-1X24: PIN HEADER
JPOT1-JPOT4 = pinhead:PINHD-1X3: PIN HEADER
JUSB_A JUSB_B = pinhead:PINHD-1X4: PIN HEADER
R1-R18 = resistor-nick:R-US_: RESISTOR, American symbol
SV1 = MusicThingModular:EURO_POWER_HEADER: Power Header 10 pin power header for Eurorack Power Supplies Variants with fatter pads for easier soldering, and the LOCK variant which has 5mil offset pins to hold the component in place before soldering
TP1 TP2 = SparkFun-Connectors:TEST-POINT: SparkFun Test Points Bare copper test points for troubleshooting or In-Circuit-Testing. These are used by our Production team for verifying production board runs using pogo-pins on test beds. SparkFun Products: SparkFun LSM9DS1 Breakout <https://www.sparkfun.com/products/13284> SparkFun PSOC <https://www.sparkfun.com/products/13714> SparkFun Load Cell Amplifier <https://www.sparkfun.com/products/13879>
U1 = Analog Devices - AD5754BREZ:ANALOG_DEVICES_AD5754BREZ: ADI-AD5754-RE-24; CIIVA_IDS: 19302561; CODE__JEDEC: MO-153-ADT; COMPONENT_LINK_1_DESCRIPTION: Manufacturer URL; COMPONENT_LINK_1_URL: http://www.analog.com/en/index.html; COMPONENT_LINK_3_DESCRIPTION: Package Specification; COMPONENT_LINK_3_URL: http://www.analog.com/static/imported-files/packages/PKG_PDF/TSSOP_EP(RE)/RE_24.pdf; COMPONENT_LINK_4_DESCRIPTION: Product URL; COMPONENT_LINK_4_URL: http://www.analog.com/en/digital-to-analog-converters/da-converters/ad5754/products/product.html; COMPONENT_LINK_5_DESCRIPTION: Reference Design URL; COMPONENT_LINK_5_URL: http://www.analog.com/en/digital-to-analog-converters/da-converters/ad5754/products/product.html#prod_cross_sell; DAC_OUTPUTS: 4; DATASHEET: http://www.analog.com/static/imported-files/data_sheets/AD5724_5734_5754.pdf; DATASHEET_VERSION: Rev.D; FOOTPRINT_VARIANT_NAME_0: Level C; FOOTPRINT_VARIANT_NAME_1: Level B; FOOTPRINT_VARIANT_NAME_2: Level A; IMPORTED: yes; IMPORTED_FROM: vault; IMPORT_TS: 1521842289; MAX_V: 16.5V; MF: Analog Devices; MOUNTING_TECHNOLOGY: Surface Mount; MPN: AD5754BREZ; OP_PWR_DISS: 310mW; PACKAGE: RE-24; PACKAGE_DESCRIPTION: 24-Lead Thin Shrink Small Outline Package, Exposed Pad [TSSOP_EP]; PACKAGE_VERSION: 050806-A; PACKING: Tube; PIN_0_0_7_INSIDE_EDGE: clock; PREFIX: U; RELEASE_DATE: 1387058848; RESOLUTION_BITS: 16; ROHS: Yes; SETTLING_TIME: 8Âμs; SINGLE_SUPPLY: Yes; VAULT_GUID: 5B766953-034E-4E57-B804-7E383D3B0B35; VAULT_REVISION: FC4D4F7F-8E93-415A-939F-54CF7C990136
U2 = cirrus:CS42448: CODEC 6-In, 8-Out, 108 dB, 192 kHz
U3 = Analog Devices - AD7606BSTZ:ANALOG_DEVICES_AD7606BSTZ: ADI-AD7606-ST-64-2; CHANNELS: 8; CIIVA_IDS: 19303426; CODE__JEDEC: MS-026-BCD; COMPONENT_LINK_1_DESCRIPTION: Manufacturer URL; COMPONENT_LINK_1_URL: http://www.analog.com/en/index.html; COMPONENT_LINK_3_DESCRIPTION: Package Specification; COMPONENT_LINK_3_URL: http://www.analog.com/static/imported-files/packages/PKG_PDF/LQFP%28ST%29/ST_64_2.pdf; COMPONENT_LINK_4_DESCRIPTION: Product URL; COMPONENT_LINK_4_URL: http://www.analog.com/en/analog-to-digital-converters/ad-converters/ad7606/products/product.html; DATASHEET: http://www.analog.com/static/imported-files/data_sheets/AD7606_7606-6_7606-4.pdf; DATASHEET_VERSION: Rev.C; FOOTPRINT_VARIANT_NAME_0: Level C; FOOTPRINT_VARIANT_NAME_1: Level B; FOOTPRINT_VARIANT_NAME_2: Level A; IMPORTED: yes; IMPORTED_FROM: vault; IMPORT_TS: 1521847520; INTERFACE: Par, Ser, SPI; MF: Analog Devices; MOUNTING_TECHNOLOGY: Surface Mount; MPN: AD7606BSTZ; PACKAGE: ST-64-2; PACKAGE_DESCRIPTION: 64-Lead Low Profile Quad Flat Package [LQFP]; PACKAGE_VERSION: 051706-A; PACKING: Tray; PIN_0_0_9_INSIDE_EDGE: clock; PREFIX: U; RELEASE_DATE: 1387012976; RESOLUTION_BITS: 16; ROHS: Yes; THROUGHPUT_RATE_SPS: 200K; VAULT_GUID: 792B8E4F-61D1-4D38-92EB-9FD13DE1F96B; VAULT_REVISION: C442BB2E-3E40-4D7F-A525-025A8B417323
U4 = TT:MICROCHIP_MCP1700T-2502E-TT: PM-LINEREG-MCP1700-IL3; CIIVA_IDS: 3800373; CODE__IPC: SOT23-3; DATASHEET_VERSION: revB, Feb-2007; FOOTPRINT_VARIANT_NAME_0: Level C; FOOTPRINT_VARIANT_NAME_1: Level B; FOOTPRINT_VARIANT_NAME_2: Level A; IMPORTED: yes; IMPORTED_FROM: vault; IMPORT_TS: 1521849832; MF: Microchip; MPN: MCP1700T-2502E/TT; PACKAGE: SOT-23-TT3; PACKAGE_DESCRIPTION: 3-Lead Plastic Small Outline Transistor (TT) [SOT-23]; PACKAGE_VERSION: revBB, Aug-2009; PREFIX: U; RELEASE_DATE: 1300337871; VAULT_GUID: A4599790-6AB0-4BBA-B902-DD84360F56C4; VAULT_REVISION: 371DBAF1-D7B5-40D9-9DCF-4BEC08F5E525
U$1 = Teensy_3_and_LC_Series_Boards_v1.4:TEENSY_3.6_DIL: Teensy 3.6 DIL Package
U$2 = MySparkFun:OPTO_DARL_6N138S

## Module STEREO_IN
Ports: LEFT_OUT(out) RIGHT_OUT(out) AGND(out)
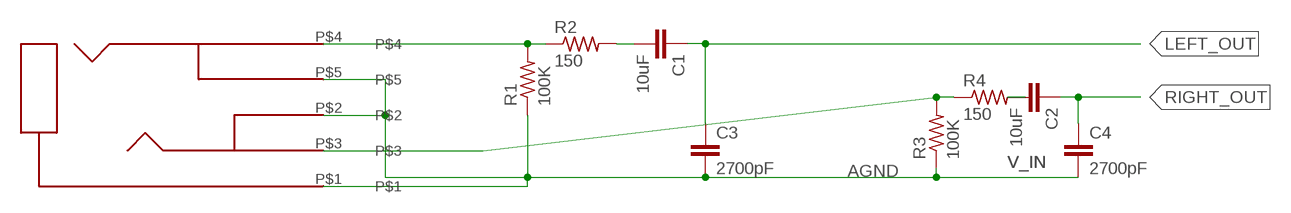
[diagram p8: schematic, module STEREO_IN, sheet 1]

### Parts
C1  10uF  C-EUC0805  [C0805]
C2  10uF  C-EUC0805  [C0805]
C3  2700pF  C-EUC0805  [C0805]
C4  2700pF  C-EUC0805  [C0805]
R1  100K  R-US_R0805  [R0805]
R2  150  R-US_R0805  [R0805]
R3  100K  R-US_R0805  [R0805]
R4  150  R-US_R0805  [R0805]
U$3  ACJS-MV-5  [ACJS-MV5]

### Nets
AGND: C3.2 C4.2 R1.1 R3.1 U$3.P$1 U$3.P$2 U$3.P$5
LEFT_OUT [defaultyyyy]: C1.1 C3.1
N$1 [defaultyyyy]: R1.2 R2.1 U$3.P$4
N$7 [defaultyyyy]: C1.2 R2.2
N$10 [defaultyyyy]: R3.2 R4.1 U$3.P$3
N$11 [defaultyyyy]: C2.2 R4.2
RIGHT_OUT [defaultyyyy]: C2.1 C4.1

### Library data of the parts
C1-C4 = resistor:C-EU: CAPACITOR, European symbol
R1-R4 = resistor-nick:R-US_: RESISTOR, American symbol
U$3 = acjs-mv:ACJS-MV-5

## Module STEREO_OUT
Ports: LEFT(out) RIGHT(out) AGND(out)
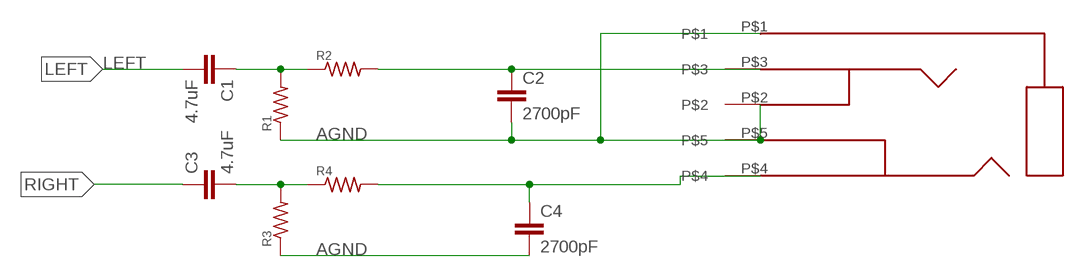
[diagram p9: schematic, module STEREO_OUT, sheet 1]

### Parts
C1  4.7uF  C-EUC0805  [C0805]
C2  2700pF  C-EUC0805  [C0805]
C3  4.7uF  C-EUC0805  [C0805]
C4  2700pF  C-EUC0805  [C0805]
J_OUT  ACJS-MV-5  [ACJS-MV5]
R1  10K  R-US_R0805  [R0805]
R2  560  R-US_R0805  [R0805]
R3  10K  R-US_R0805  [R0805]
R4  560  R-US_R0805  [R0805]

### Nets
AGND: C2.2 C4.2 J_OUT.P$1 J_OUT.P$2 J_OUT.P$5 R1.1 R3.1
LEFT [defaultyyyy]: C1.2
N$1 [defaultyyyy]: C3.2 R3.2 R4.1
N$3 [defaultyyyy]: C2.1 J_OUT.P$3 R2.2
N$4: C4.1 J_OUT.P$4 R4.2
N$17 [defaultyyyy]: C1.1 R1.2 R2.1
RIGHT [defaultyyyy]: C3.1

### Library data of the parts
C1-C4 = resistor:C-EU: CAPACITOR, European symbol
J_OUT = acjs-mv:ACJS-MV-5
R1-R4 = resistor-nick:R-US_: RESISTOR, American symbol

## Net classes
0 POWERzzz: width 0.254 mm